# EAGLE schematic Varella_Std - v.2.0 (EAGLE 9.4.2)
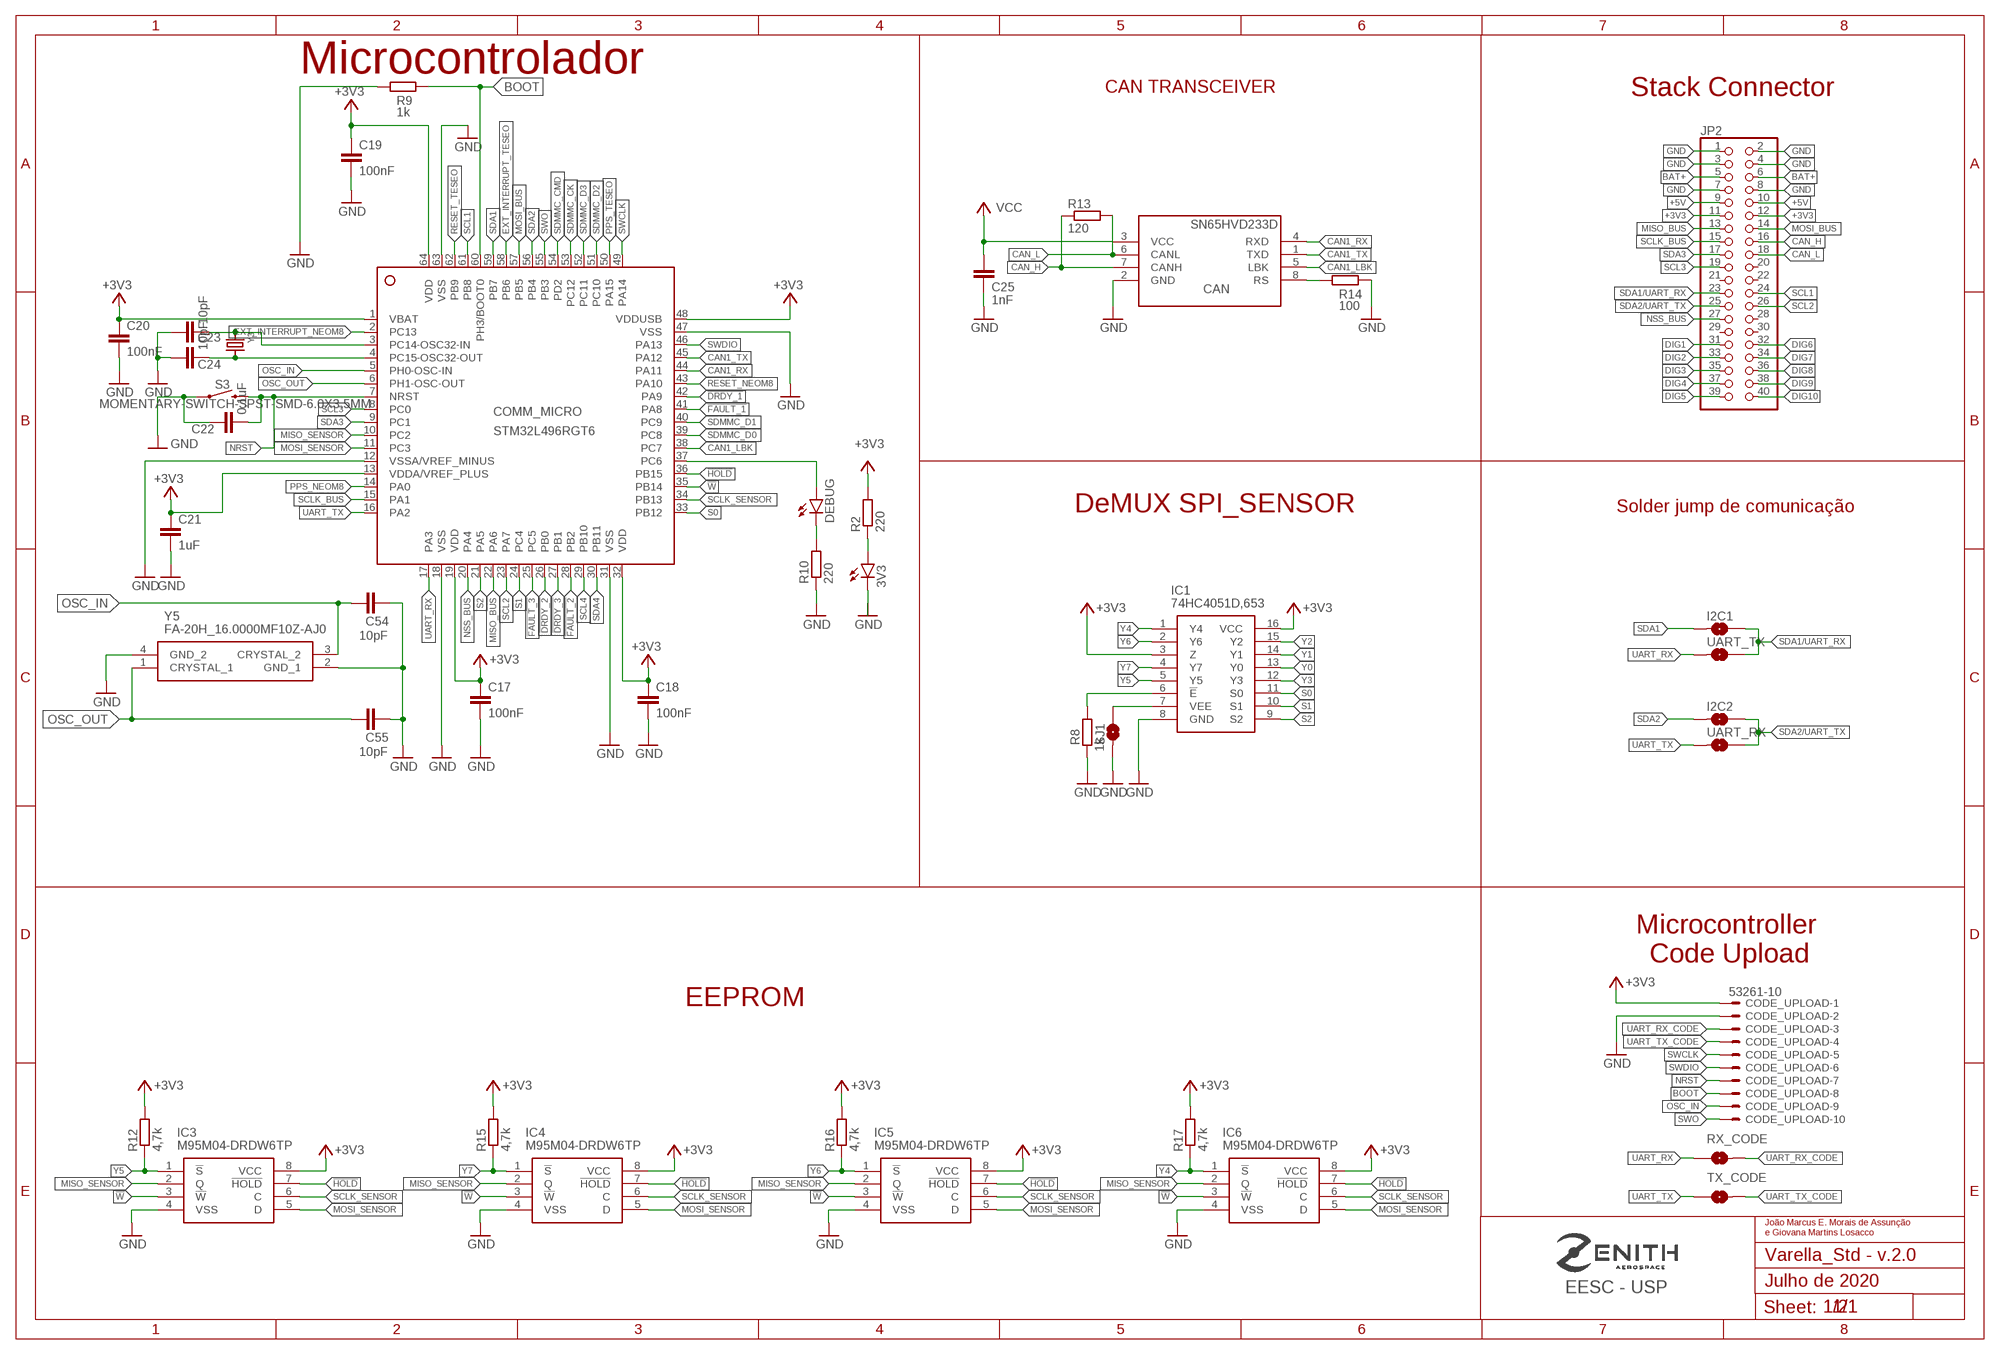
[diagram p0: schematic, sheet 1, part 1 of 2]
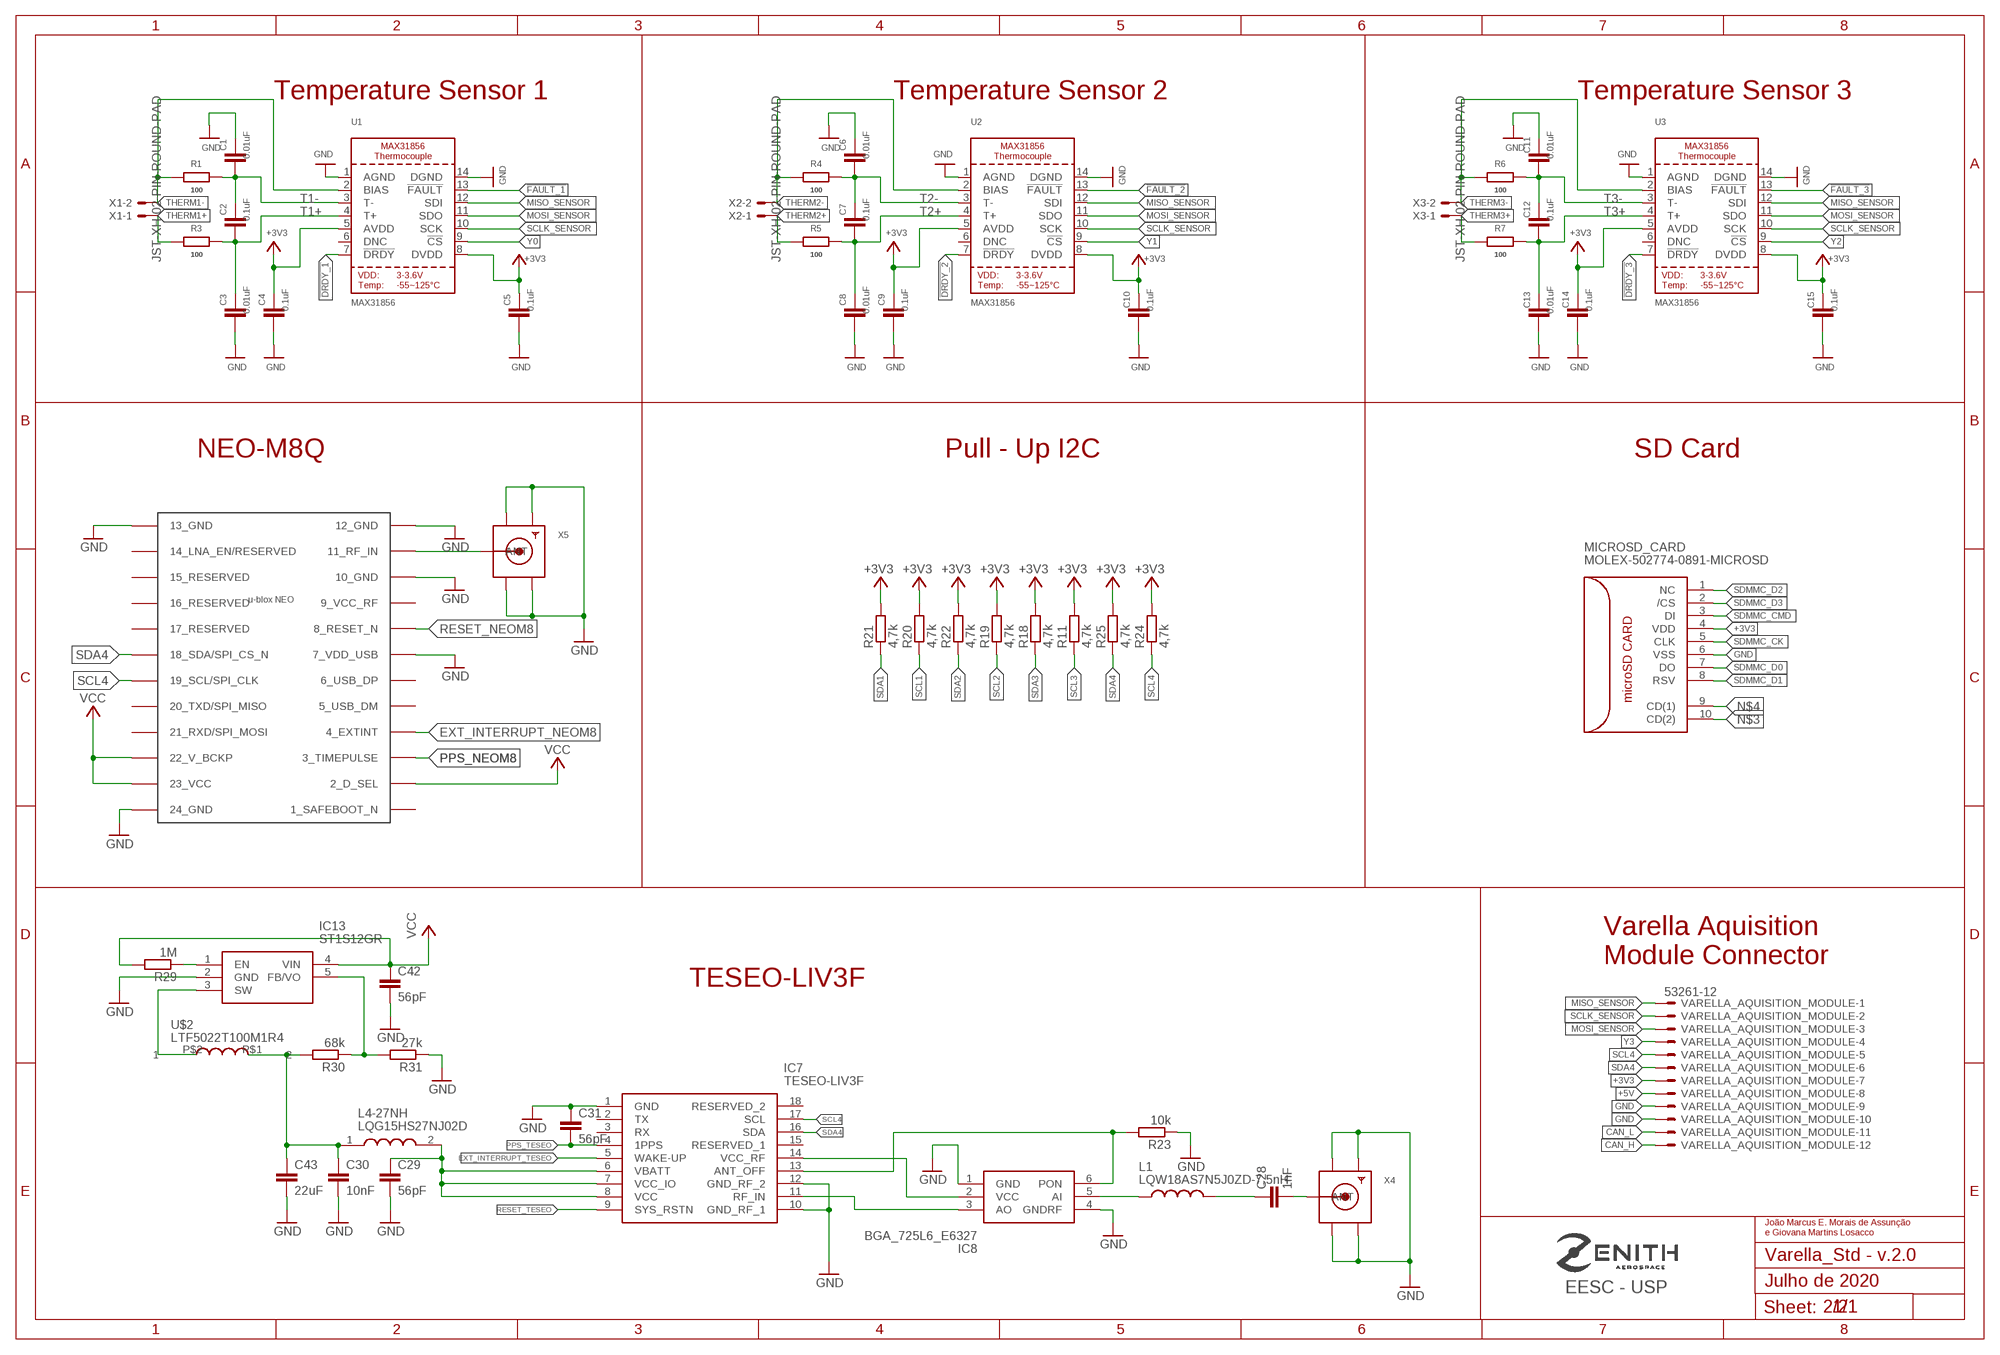
[diagram p1: schematic, sheet 1, part 2 of 2]

## Parts
3V3  LEDCHIP-LED0805  [CHIP-LED0805]
C1  0.01uF  C-EUC0805  [C0805]
C2  0.1uF  C-EUC0805  [C0805]
C3  0.01uF  C-EUC0805  [C0805]
C4  0.1uF  C-EUC0805  [C0805]
C5  0.1uF  C-EUC0805  [C0805]
C6  0.01uF  C-EUC0805  [C0805]
C7  0.1uF  C-EUC0805  [C0805]
C8  0.01uF  C-EUC0805  [C0805]
C9  0.1uF  C-EUC0805  [C0805]
C10  0.1uF  C-EUC0805  [C0805]
C11  0.01uF  C-EUC0805  [C0805]
C12  0.1uF  C-EUC0805  [C0805]
C13  0.01uF  C-EUC0805  [C0805]
C14  0.1uF  C-EUC0805  [C0805]
C15  0.1uF  C-EUC0805  [C0805]
C17  100nF  C-EUC0805  [C0805]
C18  100nF  C-EUC0805  [C0805]
C19  100nF  C-EUC0805  [C0805]
C20  100nF  C-EUC0805  [C0805]
C21  1uF  C-EUC0805  [C0805]
C22  0,1uF  C-EUC0805  [C0805]
C23  10pF  C-EUC0805  [C0805]
C24  10pF  C-EUC0805  [C0805]
C25  1nF  C-EUC1206  [C1206]
C28  1nF  C-EUC1206  [C1206]
C29  56pF  C-EUC1206  [C1206]
C30  10nF  C-EUC1206  [C1206]
C31  56pF  C-EUC1206  [C1206]
C42  56pF  C-EUC1206  [C1206]
C43  22uF  C-EUC1206  [C1206]
C54  10pF  C-EUC0805  [C0805]
C55  10pF  C-EUC0805  [C0805]
CAN  SN65HVD233D  [SOIC8]
CODE_UPLOAD  53261-10  [53261-10]
COMM_MICRO  STM32L496RGT6  [LQFP64_10X10]
DEBUG  LEDCHIP-LED0805  [CHIP-LED0805]
I2C1  SMD-JUMPER-2  [SMD-JUMPER-2]
I2C2  SMD-JUMPER-2  [SMD-JUMPER-2]
IC1  74HC4051D,653  [SOIC127P600X175-16N]
IC3  M95M04-DRDW6TP  [SOP65P640X120-8N]
IC4  M95M04-DRDW6TP  [SOP65P640X120-8N]
IC5  M95M04-DRDW6TP  [SOP65P640X120-8N]
IC6  M95M04-DRDW6TP  [SOP65P640X120-8N]
IC7  TESEO-LIV3F  [SON110P970X1010X230-18N]
IC8  BGA_725L6_E6327  [BGA725L6E6327]
IC13  ST1S12GR  [SOT95P280X110-5N]
JP2  PINHD-2X20  [2X20]
L1  LQW18AS7N5J0ZD-7,5nH  LQW18AS7N5J0ZD  [INDC1608X100N]
L4-27NH  LQG15HS27NJ02D  [LQG15WH0N7B02D]
MICROSD_CARD  MOLEX-502774-0891-MICROSD  [MOLEX-502774-0891-MICROSD]
R1  100  R-EU_R0805  [R0805]
R2  220  R-EU_R0805  [R0805]
R3  100  R-EU_R0805  [R0805]
R4  100  R-EU_R0805  [R0805]
R5  100  R-EU_R0805  [R0805]
R6  100  R-EU_R0805  [R0805]
R7  100  R-EU_R0805  [R0805]
R8  1k  R-EU_R0805  [R0805]
R9  1k  R-EU_R0805  [R0805]
R10  220  R-EU_R0805  [R0805]
R11  4,7k  R-EU_R0805  [R0805]
R12  4,7k  R-EU_R0805  [R0805]
R13  120  R-EU_R1206  [R1206]
R14  100  R-EU_R0805  [R0805]
R15  4,7k  R-EU_R0805  [R0805]
R16  4,7k  R-EU_R0805  [R0805]
R17  4,7k  R-EU_R0805  [R0805]
R18  4,7k  R-EU_R0805  [R0805]
R19  4,7k  R-EU_R0805  [R0805]
R20  4,7k  R-EU_R0805  [R0805]
R21  4,7k  R-EU_R0805  [R0805]
R22  4,7k  R-EU_R0805  [R0805]
R23  10k  R-EU_M1206  [M1206]
R24  4,7k  R-EU_R0805  [R0805]
R25  4,7k  R-EU_R0805  [R0805]
R29  1M  R-EU_M1206  [M1206]
R30  68k  R-EU_M1206  [M1206]
R31  27k  R-EU_M1206  [M1206]
RX_CODE  SMD-JUMPER-2  [SMD-JUMPER-2]
S3  MOMENTARY-SWITCH-SPST-SMD-6.0X3.5MM  [TACTILE_SWITCH_SMD_6.0X3.5MM]
SJ1  SMD-JUMPER-2  [SMD-JUMPER-2]
TX_CODE  SMD-JUMPER-2  [SMD-JUMPER-2]
U1  MAX31856  [TSSOP14]
U2  MAX31856  [TSSOP14]
U3  MAX31856  [TSSOP14]
U$2  LTF5022T100M1R4  [LTF5022T]
U$3  NEO-M8  [NEO-M8]
UART_RX  SMD-JUMPER-2  [SMD-JUMPER-2]
UART_TX  SMD-JUMPER-2  [SMD-JUMPER-2]
VARELLA_AQUISITION_MODULE  53261-12  [53261-12]
X1  JST-XH-02-PIN-ROUND-PAD  [JST-XH-02-PACKAGE-ROUND-PAD]
X2  JST-XH-02-PIN-ROUND-PAD  [JST-XH-02-PACKAGE-ROUND-PAD]
X3  JST-XH-02-PIN-ROUND-PAD  [JST-XH-02-PACKAGE-ROUND-PAD]
X4  SMACONNECTOR  [SMA90_DIP]
X5  SMACONNECTOR  [SMA90_DIP]
Y3  CRYSTAL8X3.8SMT  [CRYSTAL_8X3.8]
Y5  FA-20H_16.0000MF10Z-AJ0  [FA20H160000MF12ZAC3]

## Nets
!DRDY_1: COMM_MICRO.42(PA9) U1.7(!DRDY)
!DRDY_2: COMM_MICRO.26(PB0) U2.7(!DRDY)
!DRDY_3: COMM_MICRO.27(PB1) U3.7(!DRDY)
!FAULT_1: COMM_MICRO.41(PA8) U1.13(!FAULT)
!FAULT_2: COMM_MICRO.28(PB2) U2.13(!FAULT)
!FAULT_3: COMM_MICRO.25(PC5) U3.13(!FAULT)
!HOLD: COMM_MICRO.36(PB15) IC3.7(!HOLD) IC4.7(!HOLD) IC5.7(!HOLD) IC6.7(!HOLD)
!W: COMM_MICRO.35(PB14) IC3.3(!W) IC4.3(!W) IC5.3(!W) IC6.3(!W)
+3V3: C4.1 C5.1 C9.1 C10.1 C14.1 C15.1 C17.1 C18.1 C19.1 C20.1 C21.1 C25.1 C42.1 CAN.3(VCC) CODE_UPLOAD.1 COMM_MICRO.1(VBAT) COMM_MICRO.13(VDDA/VREF_PLUS) COMM_MICRO.19(VDD) COMM_MICRO.32(VDD) COMM_MICRO.48(VDDUSB) COMM_MICRO.64(VDD) IC1.3(Z) IC1.16(VCC) IC3.8(VCC) IC4.8(VCC) IC5.8(VCC) IC6.8(VCC) IC13.4(VIN) JP2.11 JP2.12 MICROSD_CARD.4(VDD) R2.2 R11.2 R12.2 R15.2 R16.2 R17.2 R18.2 R19.2 R20.2 R21.1 R22.1 R24.2 R25.2 R29.2 U1.5(AVDD) U1.8(DVDD) U2.5(AVDD) U2.8(DVDD) U3.5(AVDD) U3.8(DVDD) U$3.2(2_D_SEL) U$3.22(22_V_BCKP) U$3.23(23_VCC) VARELLA_AQUISITION_MODULE.7 ; supply symbol labelled VCC
+5V: JP2.9 JP2.10 VARELLA_AQUISITION_MODULE.8
BAT+: JP2.5 JP2.6
BOOT: CODE_UPLOAD.8 COMM_MICRO.60(PH3/BOOT0) R9.1
CAN1_LBK: CAN.5(LBK) COMM_MICRO.38(PC7)
CAN1_RX: CAN.4(RXD) COMM_MICRO.44(PA11)
CAN1_TX: CAN.1(TXD) COMM_MICRO.45(PA12)
CAN_H: CAN.7(CANH) JP2.16 R13.1 VARELLA_AQUISITION_MODULE.12
CAN_L: CAN.6(CANL) JP2.18 R13.2 VARELLA_AQUISITION_MODULE.11
DIG1: JP2.31
DIG2: JP2.33
DIG3: JP2.35
DIG4: JP2.37
DIG5: JP2.39
DIG6: JP2.32
DIG7: JP2.34
DIG8: JP2.36
DIG9: JP2.38
DIG10: JP2.40
EXT_INTERRUPT_NEOM8: COMM_MICRO.2(PC13) U$3.4(4_EXTINT)
EXT_INTERRUPT_TESEO: COMM_MICRO.58(PB6) IC7.5(WAKE-UP)
GND: 3V3.C C1.1 C3.2 C4.2 C5.2 C6.1 C8.2 C9.2 C10.2 C11.1 C13.2 C14.2 C15.2 C17.2 C18.2 C19.2 C20.2 C21.2 C22.1 C23.1 C24.1 C25.2 C29.2 C30.2 C31.1 C42.2 C43.2 C54.2 C55.2 CAN.2(GND) CODE_UPLOAD.2 COMM_MICRO.12(VSSA/VREF_MINUS) COMM_MICRO.18(VSS) COMM_MICRO.31(VSS) COMM_MICRO.47(VSS) COMM_MICRO.63(VSS) IC1.8(GND) IC3.4(VSS) IC4.4(VSS) IC5.4(VSS) IC6.4(VSS) IC7.1(GND) IC7.10(GND_RF_1) IC7.12(GND_RF_2) IC8.1(GND) IC8.4(GNDRF) IC13.2(GND) JP2.1 JP2.2 JP2.3 JP2.4 JP2.7 JP2.8 MICROSD_CARD.6(VSS) R8.1 R9.2 R10.1 R14.1 R23.1 R31.1 S3.1 SJ1.2 U1.1(AGND) U1.14(DGND) U2.1(AGND) U2.14(DGND) U3.1(AGND) U3.14(DGND) U$3.7(7_VDD_USB) U$3.10(10_GND) U$3.12(12_GND) U$3.13(13_GND) U$3.24(24_GND) VARELLA_AQUISITION_MODULE.9 VARELLA_AQUISITION_MODULE.10 X4.GND1 X4.GND2 X4.GND3 X4.GND4 X5.GND1 X5.GND2 X5.GND3 X5.GND4 Y5.2(GND_1) Y5.4(GND_2)
L3: 3V3.A R2.1
MISO_BUS: COMM_MICRO.22(PA6) JP2.13
MISO_SENSOR: COMM_MICRO.10(PC2) IC3.2(Q) IC4.2(Q) IC5.2(Q) IC6.2(Q) U1.12(SDI) U2.12(SDI) U3.12(SDI) VARELLA_AQUISITION_MODULE.1
MOSI_BUS: COMM_MICRO.57(PB5) JP2.14
MOSI_SENSOR: COMM_MICRO.11(PC3) IC3.5(D) IC4.5(D) IC5.5(D) IC6.5(D) U1.11(SDO) U2.11(SDO) U3.11(SDO) VARELLA_AQUISITION_MODULE.3
N$1: IC1.7(VEE) SJ1.1
N$3: MICROSD_CARD.10(CD(2))
N$4: MICROSD_CARD.9(CD(1))
N$5: U$3.11(11_RF_IN) X5.ANTENNA(ANT)
N$6: C29.1 IC7.6(VBATT) IC7.7(VCC_IO) IC7.8(VCC) L4-27NH.2
N$7: IC7.14(VCC_RF) IC8.2(VCC)
N$8: IC1.6(!E) R8.2
N$9: C28.2 X4.ANTENNA(ANT)
N$11: COMM_MICRO.37(PC6) DEBUG.A
N$12: DEBUG.C R10.2
N$13: C23.2 COMM_MICRO.3(PC14-OSC32-IN) Y3.P$1
N$14: C24.2 COMM_MICRO.4(PC15-OSC32-OUT) Y3.P$4
N$15: IC7.11(RF_IN) IC8.3(AO)
N$16: IC7.13(ANT_OFF) IC8.6(PON) R23.2
N$17: CAN.8(RS) R14.2
N$18: C28.1 L1.2
N$19: IC8.5(AI) L1.1
N$37: IC13.1(EN) R29.1
N$38: IC13.3(SW) U$2.P$2
N$39: IC13.5(FB/VO) R30.1 R31.2
NRST: C22.2 CODE_UPLOAD.7 COMM_MICRO.7(NRST) S3.2
NSS_BUS: COMM_MICRO.20(PA4) JP2.27
OSC_IN: C54.1 CODE_UPLOAD.9 COMM_MICRO.5(PH0-OSC-IN) Y5.3(CRYSTAL_2)
OSC_OUT: C55.1 COMM_MICRO.6(PH1-OSC-OUT) Y5.1(CRYSTAL_1)
PPS_NEOM8: COMM_MICRO.14(PA0) U$3.3(3_TIMEPULSE)
PPS_TESEO: C31.2 COMM_MICRO.50(PA15) IC7.4(1PPS)
RESET_NEOM8: COMM_MICRO.43(PA10) U$3.8(8_RESET_N)
RESET_TESEO: COMM_MICRO.62(PB9) IC7.9(SYS_RSTN)
S0: COMM_MICRO.33(PB12) IC1.11(S0)
S1: COMM_MICRO.24(PC4) IC1.10(S1)
S2: COMM_MICRO.21(PA5) IC1.9(S2)
SCL1: COMM_MICRO.61(PB8) JP2.24 R20.1
SCL2: COMM_MICRO.23(PA7) JP2.26 R19.1
SCL3: COMM_MICRO.8(PC0) JP2.19 R11.1
SCL4: COMM_MICRO.29(PB10) IC7.17(SCL) R24.1 U$3.19(19_SCL/SPI_CLK) VARELLA_AQUISITION_MODULE.5
SCLK_BUS: COMM_MICRO.15(PA1) JP2.15
SCLK_SENSOR: COMM_MICRO.34(PB13) IC3.6(C) IC4.6(C) IC5.6(C) IC6.6(C) U1.10(SCK) U2.10(SCK) U3.10(SCK) VARELLA_AQUISITION_MODULE.2
SDA1: COMM_MICRO.59(PB7) I2C1.2 R21.2
SDA1/UART_RX: I2C1.1 JP2.23 UART_TX.1
SDA2: COMM_MICRO.56(PB4) I2C2.2 R22.2
SDA2/UART_TX: I2C2.1 JP2.25 UART_RX.1
SDA3: COMM_MICRO.9(PC1) JP2.17 R18.1
SDA4: COMM_MICRO.30(PB11) IC7.16(SDA) R25.1 U$3.18(18_SDA/SPI_CS_N) VARELLA_AQUISITION_MODULE.6
SDMMC_CK: COMM_MICRO.53(PC12) MICROSD_CARD.5(CLK)
SDMMC_CMD: COMM_MICRO.54(PD2) MICROSD_CARD.3(DI)
SDMMC_D0: COMM_MICRO.39(PC8) MICROSD_CARD.7(DO)
SDMMC_D1: COMM_MICRO.40(PC9) MICROSD_CARD.8(RSV)
SDMMC_D2: COMM_MICRO.51(PC10) MICROSD_CARD.1(NC)
SDMMC_D3: COMM_MICRO.52(PC11) MICROSD_CARD.2(/CS)
SWCLK: CODE_UPLOAD.5 COMM_MICRO.49(PA14)
SWDIO: CODE_UPLOAD.6 COMM_MICRO.46(PA13)
SWO: CODE_UPLOAD.10 COMM_MICRO.55(PB3)
T1+: C2.2 C3.1 R3.2 U1.4(T+)
T1-: C1.2 C2.1 R1.2 U1.3(T-)
T2+: C7.2 C8.1 R5.2 U2.4(T+)
T2-: C6.2 C7.1 R4.2 U2.3(T-)
T3+: C12.2 C13.1 R7.2 U3.4(T+)
T3-: C11.2 C12.1 R6.2 U3.3(T-)
TESEO3: C30.1 C43.1 L4-27NH.1 R30.2 U$2.P$1
THERM1+: R3.1 X1.1
THERM1-: R1.1 U1.2(BIAS) X1.2
THERM2+: R5.1 X2.1
THERM2-: R4.1 U2.2(BIAS) X2.2
THERM3+: R7.1 X3.1
THERM3-: R6.1 U3.2(BIAS) X3.2
UART_RX: COMM_MICRO.17(PA3) RX_CODE.1 UART_TX.2
UART_RX_CODE: CODE_UPLOAD.3 RX_CODE.2
UART_TX: COMM_MICRO.16(PA2) TX_CODE.1 UART_RX.2
UART_TX_CODE: CODE_UPLOAD.4 TX_CODE.2
Y0: IC1.13(Y0) U1.9(!CS)
Y1: IC1.14(Y1) U2.9(!CS)
Y2: IC1.15(Y2) U3.9(!CS)
Y3: IC1.12(Y3) VARELLA_AQUISITION_MODULE.4
Y4: IC1.1(Y4) IC6.1(!S) R17.1
Y5: IC1.5(Y5) IC3.1(!S) R12.1
Y6: IC1.2(Y6) IC5.1(!S) R16.1
Y7: IC1.4(Y7) IC4.1(!S) R15.1
Unconnected: IC7.2(TX) IC7.3(RX) IC7.15(RESERVED_1) IC7.18(RESERVED_2) JP2.20 JP2.21 JP2.22 JP2.28 JP2.29 JP2.30 U1.6(DNC) U2.6(DNC) U3.6(DNC) U$3.1(1_SAFEBOOT_N) U$3.5(5_USB_DM) U$3.6(6_USB_DP) U$3.9(9_VCC_RF) U$3.14(14_LNA_EN/RESERVED) U$3.15(15_RESERVED) U$3.16(16_RESERVED) U$3.17(17_RESERVED) U$3.20(20_TXD/SPI_MISO) U$3.21(21_RXD/SPI_MOSI)

## Notes on the sheet
- Microcontrolador
- CAN TRANSCEIVER | Stack Connector
- Temperature Sensor 1 | Temperature Sensor 2 | Temperature Sensor 3
- NEO-M8Q | Pull - Up I2C | SD Card
- DeMUX SPI_SENSOR | Solder jump de comunicação
- Microcontroller
   Code Upload
- Varella Aquisition 
  Module Connector
- TESEO-LIV3F
- EEPROM
- João Marcus E. Morais de Assunção
  e Giovana Martins Losacco
- João Marcus E. Morais de Assunção
  e Giovana Martins Losacco
- EESC - USP | Julho de 2020 | EESC - USP | Julho de 2020
- 1/2 | 2/2

## Library data of the parts
3V3 DEBUG = led:LED: LED OSRAM: - CHIPLED LG R971, LG N971, LY N971, LG Q971, LY Q971, LO R971, LY R971 LH N974, LH R974 LS Q976, LO Q976, LY Q976 LO Q996 - Hyper CHIPLED LW Q18S LB Q993, LB Q99A, LB R99A - SideLED LS A670, LO A670, LY A670, LG A670, LP A670 LB A673, LV A673, LT A673, LW A673 LH A674 LY A675 LS A676, LA A676, LO A676, LY A676, LW A676 LS A679, LY A679, LG A679 - Hyper Micro SIDELED® LS Y876, LA Y876, LO Y876, LY Y876 LT Y87S - SmartLED LW L88C, LW L88S LB L89C, LB L89S, LG L890 LS L89K, LO L89K, LY L89K LS L896, LA L896, LO L896, LY L896 - TOPLED LS T670, LO T670, LY T670, LG T670, LP T670 LSG T670, LSP T670, LSY T670, LOP T670, LYG T670 LG T671, LOG T671, LSG T671 LB T673, LV T673, LT T673, LW T673 LH T674 LS T676, LA T676, LO T676, LY T676, LB T676, LH T676, LSB T676, LW T676 LB T67C, LV T67C, LT T67C, LS T67K, LO T67K, LY T67K, LW E67C LS E67B, LA E67B, LO E67B, LY E67B, LB E67C, LV E67C, LT E67C LW T67C LS T679, LY T679, LG T679 LS T770, LO T770, LY T770, LG T770, LP T770 LB T773, LV T773, LT T773, LW T773 LH T774 LS E675, LA E675, LY E675, LS T675 LS T776, LA T776, LO T776, LY T776, LB T776 LHGB T686 LT T68C, LB T68C - Hyper Mini TOPLED® LB M676 - Mini TOPLED Santana® LG M470 LS M47K, LO M47K, LY M47K Source: http://www.osram.convergy.de LUXEON: - LUMILED® LXK2-PW12-R00, LXK2-PW12-S00, LXK2-PW14-U00, LXK2-PW14-V00 LXK2-PM12-R00, LXK2-PM12-S00, LXK2-PM14-U00 LXK2-PE12-Q00, LXK2-PE12-R00, LXK2-PE12-S00, LXK2-PE14-T00, LXK2-PE14-U00 LXK2-PB12-K00, LXK2-PB12-L00, LXK2-PB12-M00, LXK2-PB14-N00, LXK2-PB14-P00, LXK2-PB14-Q00 LXK2-PR12-L00, LXK2-PR12-M00, LXK2-PR14-Q00, LXK2-PR14-R00 LXK2-PD12-Q00, LXK2-PD12-R00, LXK2-PD12-S00 LXK2-PH12-R00, LXK2-PH12-S00 LXK2-PL12-P00, LXK2-PL12-Q00, LXK2-PL12-R00 Source: www.luxeon.com KINGBRIGHT: KA-3528ASYC Source: www.kingbright.com
C1-C15 C17-C25 C28-C31 C42 C43 C54 C55 = rcl:C-EU: CAPACITOR, European symbol; SPICEPREFIX: C
CAN = SN65HVD233D:SN65HVD233D; AVAILABILITY: Unavailable; DESCRIPTION: 3.3V CAN Transceiver with Standby Mode, Loop-back 8-SOIC -40 to 125; MF: Texas Instruments; MP: SN65HVD233D; PACKAGE: SOIC-8 Texas Instruments; PRICE: None
CODE_UPLOAD = con-molex:53?-10: CONNECTOR wire to board 1.25 mm (.049 inch) pitch header; MF: MOLEX; OC_FARNELL: unknown; OC_NEWARK: unknown
COMM_MICRO = STM32L4xxx:STM32L496R*: STM32L496RX LQFP64 Cortex M4, 80MHz, 512kB-1024kB Flash, 320kB SRAM Datasheet STM32L496XX <http://www.st.com/content/ccc/resource/technical/document/datasheet/group3/3f/73/19/d1/d4/9e/48/34/DM00284211/files/DM00284211.pdf/jcr:content/translations/en.DM00284211.pdf>; FARNELL: 2725138; FLASH: 1024kB; SRAM: 320kB
I2C1 I2C2 RX_CODE SJ1 TX_CODE UART_RX UART_TX = FaBo-PIN:SMD-JUMPER-2
IC1 = SamacSys_Parts:74HC4051D,653: 74HC4051; 74HCT4051 - 8-channel analog multiplexer/demultiplexer@en-us Source: Datasheet <https://assets.nexperia.com/documents/data-sheet/74HC_HCT4051.pdf>; DESCRIPTION: 74HC4051; 74HCT4051 - 8-channel analog multiplexer/demultiplexer@en-us; HEIGHT: 1.75mm; MANUFACTURER_NAME: Nexperia; MANUFACTURER_PART_NUMBER: 74HC4051D,653; MOUSER_PART_NUMBER: 771-74HC4051D-T; MOUSER_PRICE-STOCK: https://www.mouser.co.uk/ProductDetail/Nexperia/74HC4051D653?qs=P62ublwmbi%2FWMqN3hyrSvQ%3D%3D
IC3-IC6 = SamacSys_Parts:M95M04-DRDW6TP: EEPROM 4-Mbit serial SPI bus EEPROM Source: Datasheet <https://componentsearchengine.com/Datasheets/1/M95M04-DRDW6TP.pdf>; DESCRIPTION: EEPROM 4-Mbit serial SPI bus EEPROM; HEIGHT: 1.2mm; MANUFACTURER_NAME: STMicroelectronics; MANUFACTURER_PART_NUMBER: M95M04-DRDW6TP; MOUSER_PART_NUMBER: 511-M95M04-DRDW6TP; MOUSER_PRICE-STOCK: https://www.mouser.co.uk/ProductDetail/STMicroelectronics/M95M04-DRDW6TP?qs=wnTfsH77Xs5ZmZ71YtTm4A%3D%3D
IC7 = SamacSys_Parts:TESEO-LIV3F: GPS Modules Tiny GNSS module Source: Datasheet <https://www.st.com/resource/en/datasheet/teseo-liv3f.pdf>; ARROW_PART_NUMBER: TESEO-LIV3F; ARROW_PRICE-STOCK: https://www.arrow.com/en/products/teseo-liv3f/stmicroelectronics; DESCRIPTION: GPS Modules Tiny GNSS module; HEIGHT: 2.3mm; MANUFACTURER_NAME: STMicroelectronics; MANUFACTURER_PART_NUMBER: TESEO-LIV3F; MOUSER_PART_NUMBER: 511-TESEO-LIV3F; MOUSER_PRICE-STOCK: https://www.mouser.co.uk/ProductDetail/STMicroelectronics/TESEO-LIV3F?qs=HXFqYaX1Q2wXp9tn7dEmMw%3D%3D
IC8 = SamacSys_Parts:BGA_725L6_E6327: INFINEON - BGA 725L6 E6327 - RF AMP, 20DB, 1.615GHZ, 3.6V, TSLP-6 Source: Datasheet <https://www.infineon.com/dgdl/Infineon-BGA725L6-DS-v02_00-en.pdf?fileId=db3a30433784a0400137ef9a4d341f23>; DESCRIPTION: INFINEON - BGA 725L6 E6327 - RF AMP, 20DB, 1.615GHZ, 3.6V, TSLP-6; HEIGHT: 0.4mm; MANUFACTURER_NAME: Infineon; MANUFACTURER_PART_NUMBER: BGA 725L6 E6327; MOUSER_PART_NUMBER: 726-BGA725L6E6327; MOUSER_PRICE-STOCK: https://www.mouser.co.uk/ProductDetail/Infineon-Technologies/BGA-725L6-E6327?qs=l6ZoeTYLMwPIme2fOcdDvg%3D%3D
IC13 = SamacSys_Parts:ST1S12GR: STMICROELECTRONICS - ST1S12GR - DC/DC CONV, BUCK, 1.7MHZ, TSOT-23-5 Source: Datasheet <https://www.st.com/resource/en/datasheet/st1s12xx.pdf>; ARROW_PART_NUMBER: ST1S12GR; ARROW_PRICE-STOCK: https://www.arrow.com/en/products/st1s12gr/stmicroelectronics; DESCRIPTION: STMICROELECTRONICS - ST1S12GR - DC/DC CONV, BUCK, 1.7MHZ, TSOT-23-5; HEIGHT: 1.1mm; MANUFACTURER_NAME: STMicroelectronics; MANUFACTURER_PART_NUMBER: ST1S12GR; MOUSER_PART_NUMBER: 511-ST1S12GR; MOUSER_PRICE-STOCK: https://www.mouser.co.uk/ProductDetail/STMicroelectronics/ST1S12GR?qs=QKF3unAkNR%252BifYUR85%252B%252BAA%3D%3D
JP2 = pinhead:PINHD-2X20: PIN HEADER
L1 = LQW18AS7N5J0ZD:LQW18AS7N5J0ZD: FIXED IND 7.5NH 700MA 106 MOHM; DESCRIPTION: Inductor with Inductance: 7.5nH Tol. +/-5%, Package: 0603 (1608); DIGI-KEY_PART_NUMBER: 490-15853-1-ND; DIGIKEY-PURCHASE-URL: https://snapeda.com/shop?store=DigiKey&id=1573408; MF: Murata; MOUSER-PURCHASE-URL: https://snapeda.com/shop?store=Mouser&id=1573408; MP: LQW18AS7N5J0ZD; PACKAGE: 1608 Murata
L4-27NH = SamacSys_Parts:LQG15HS27NJ02D: Inductor SMD 0402 27nH 300mA Murata LQG15HS Series Wire-wound SMD Inductor 27 nH +/-5% Wire-Wound 300mA Idc Q:8 Source: Datasheet <https://psearch.en.murata.com/inductor/product/LQG15HS27NJ02#.html>; DESCRIPTION: Inductor SMD 0402 27nH 300mA Murata LQG15HS Series Wire-wound SMD Inductor 27 nH +/-5% Wire-Wound 300mA Idc Q:8; HEIGHT: 0.55mm; MANUFACTURER_NAME: Murata Electronics; MANUFACTURER_PART_NUMBER: LQG15HS27NJ02D; MOUSER_PART_NUMBER: 81-LQG15HS27NJ02D; MOUSER_PRICE-STOCK: https://www.mouser.co.uk/ProductDetail/Murata-Electronics/LQG15HS27NJ02D?qs=ctz47l0uL1AbPpSO0oLF1A%3D%3D
MICROSD_CARD = Ava:MOLEX-502774-0891-MICROSD; FARNELL: 2064063
R1-R22 R24 R25 = rcl:R-EU_: RESISTOR, European symbol; SPICEPREFIX: R
R23 R29-R31 = rcl (2):R-EU_: RESISTOR, European symbol
S3 = SparkFun-Switches:MOMENTARY-SWITCH-SPST: Momentary Switch (Pushbutton) - SPST Normally-open (NO) SPST momentary switches (buttons, pushbuttons). Variants PTH-12MM - 12mm square, through-hole Momentary Pushbutton Switch - 12mm Square <https://www.sparkfun.com/products/9190> (COM-09190) PTH-6.0MM, PTH-6.0MM-KIT - 6.0mm square, through-hole Mini Pushbutton Switch <https://www.sparkfun.com/products/97> (COM-00097) KIT package intended for soldering kit's - only one side of pads' copper is exposed. PTH-RIGHT-ANGLE-KIT - Right-angle, through-hole Right Angle Tactile Button <https://www.sparkfun.com/products/10791> - Used on SparkFun BigTime Watch Kit <https://www.sparkfun.com/products/11734> SMD-12MM - 12mm square, surface-mount Tactile Button - SMD (12mm) <https://www.sparkfun.com/products/12993> (COM-12993) Used on SparkFun PicoBoard <https://www.sparkfun.com/products/11888> SMD-4.5MM - 4.5mm Square Trackball Switch Used on SparkFun Blackberry Trackballer Breakout <https://www.sparkfun.com/products/13169> SMD-4.6MMX2.8MM - 4.60mm x 2.80mm, surface mount Used on SparkFun SAMD21 Mini Breakout <https://www.sparkfun.com/products/13664> SMD-5.2MM, SMD-5.2-REDUNDANT - 5.2mm square, surface-mount Mini Pushbutton Switch - SMD <https://www.sparkfun.com/products/8720> (COM-08720) Used on Arduino Pro Mini <https://www.sparkfun.com/products/11114> REDUNDANT package connects both switch circuits together SMD-6.0X3.5MM - 6.0 x 3.5mm, surface mount Momentary Reset Switch SMD <https://www.sparkfun.com/products/8229> (COM-08229) SMD-6.2MM-TALL - 6.2mm square, surface mount Tactile Button - SMD (6mm) <https://www.sparkfun.com/products/12992> Used on SparkFun Digital Sandbox <https://www.sparkfun.com/products/12651> SMD-RIGHT-ANGLE - Right-angle, surface mount Used on SparkFun Block for Intel® Edison - Arduino <https://www.sparkfun.com/products/13036>; PROD_ID: SWCH-00815; SF_SKU: COM-08229
U1-U3 = microbuilder:MAX31856: MAX31856 - Thermocouple Sensor ADC
U$2 = LTF5022T:LTF5022T: Inductor, 10uH
U$3 = ubloxLib:NEO-M8: u-blox NEO GNSS module
VARELLA_AQUISITION_MODULE = con-molex:53?-12: CONNECTOR wire to board 1.25 mm (.049 inch) pitch header; MF: MOLEX; MPN: 53261-1271; OC_FARNELL: 1125363; OC_NEWARK: 59J0244
X1-X3 = JST-XH-Zenith:JST-XH-02-PIN: JST XH Connector 2 Pin Wire to board connector. Pitch: 2,54 mm, (0.100") Number of pins: 2 Created by Rembrandt Electronics www.rembrandtelectronics.com
X4 X5 = adafruit:SMACONNECTOR: SMA Connector 90° DIP SMA Connector, 50 Ohm (4UConnector: 07259)
Y3 = microbuilder:CRYSTAL: Crystals HC49UP - Surface Mount Crystal 4.0MHz 18pF +/-30ppm Surface Mount Crystal [Digikey: 535-9857-1-ND] 12.0 MHz Surface Mount Crystal [Digikey: 535-9869-6-ND] 25.0 MHz Surface Mount Crystal [Digikey: 535-9078-1-ND] 2.5 x 2.0mm - MEMs SMT Crystal 16.0 MHz 10pF 20ppm 2.5 x 2.0mm Crystal [Digikey -40-85°C: 535-10923-1-ND] 3.2 x 2.5mm - MEMs SMT Crystal 12.0 MHz 8pF 15ppm 3.2 x 2.5mm Crystal [Digikey: -10-70°C: 644-1047-1-ND -40-125°C: 644-1128-1-ND] 16.0 MHz 8pF 15ppm 3.2 x 2.5mm Crystal [Digikey: -10-70°C: 644-1049-1-ND -40-125°C: 644-1129-2-ND] 16.0 MHz 10pF 10ppm 3.2 x 2.5mm Crystal [Digikey: 644-1100-1-ND] 27.12 MHz 18pF 30ppm 3.2 x 2.5mm Crystal [Digikey: 887-1424-1-ND] 27.12MHz 10pF 10ppm 3.2 x 2.5mm Crystal [Digikey: 887-1329-1-ND] 4.9 x 1.8mm - MEMs SMT Crystal 32.768 KHz 12.5pF 20ppm 4.9 x 1.8mm Crystal [Digikey: SE2415CT-ND] 8.0 x 3.8mm - Surface Mount Crystal 32.768kHz 12.5pF 20ppm -40°C-85°C [Digikey: 535-9166-2-ND] Cylinder 32.768KHz Cylinder Crystal (2x6mm body) [Ex. Digikey: 300-8341-2-ND]
Y5 = SamacSys_Parts:FA-20H_16.0000MF10Z-AJ0: Source: Datasheet <https://support.epson.biz/td/api/doc_check.php?dl=brief_FA-20H&lang=en>; HEIGHT: 0.55mm; MANUFACTURER_NAME: Epson Timing; MANUFACTURER_PART_NUMBER: FA-20H 16.0000MF10Z-AJ0; MOUSER_PART_NUMBER: 732-FA-20H16MF10ZAJ0; MOUSER_PRICE-STOCK: https://www.mouser.co.uk/ProductDetail/Epson-Timing/FA-20H-160000MF10Z-AJ0?qs=f9yNj16SXrIaU%252BY5GFRuIg%3D%3D